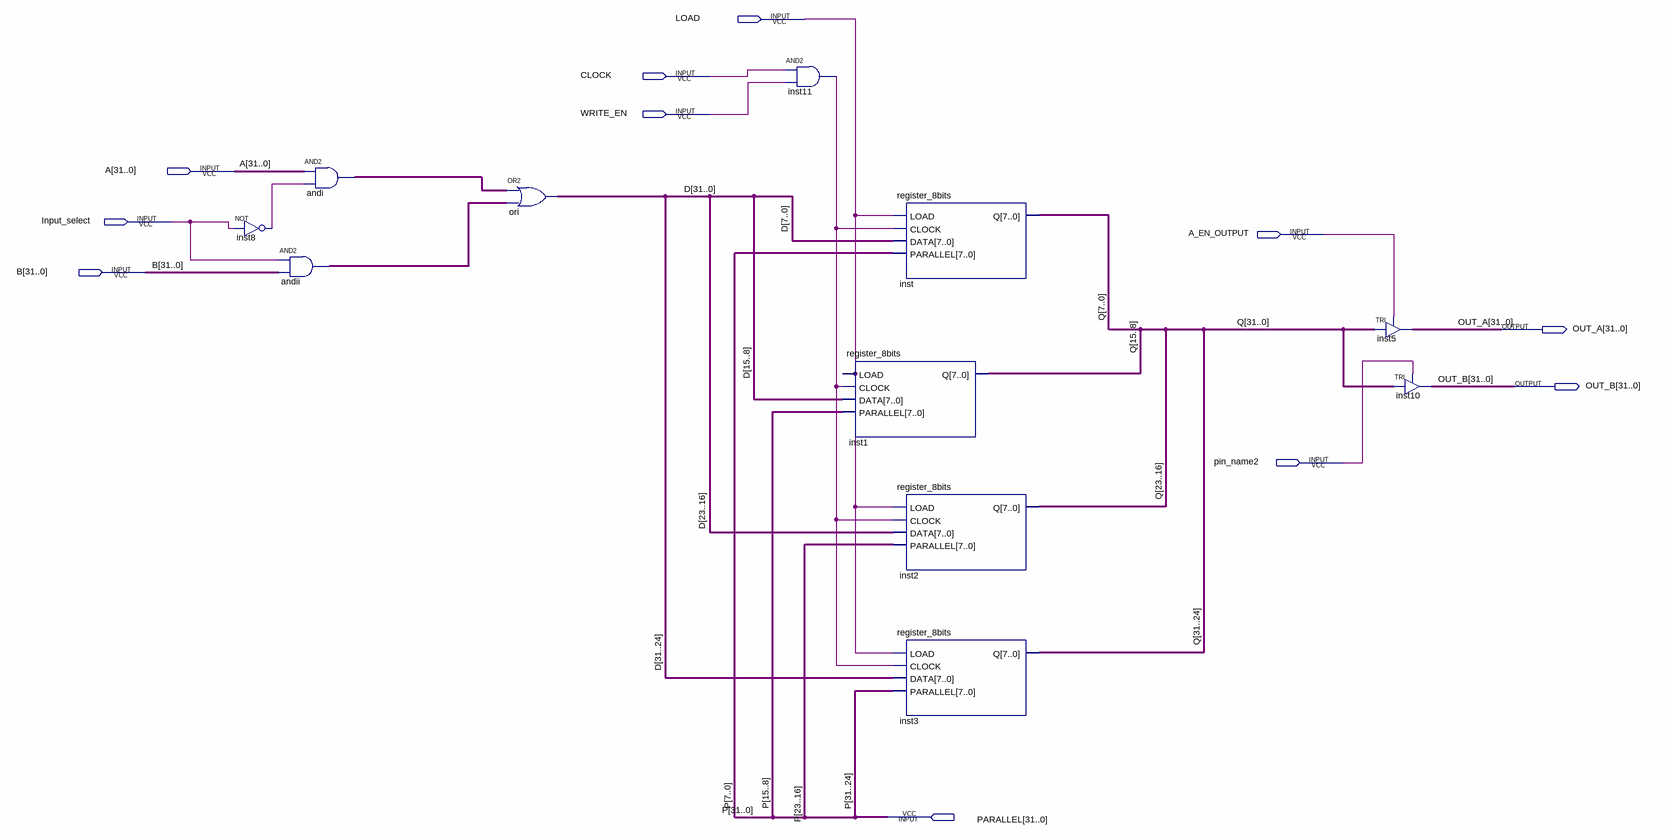
[diagram p0: schematic sheet]
// Quartus schematic register_32bits.bdf as structural Verilog: 11 symbols, 11 pins
module register_32bits (
  input  LOAD,
  input  CLOCK,
  input  WRITE_EN,
  input  [31:0] A,
  input  Input_select,
  input  A_EN_OUTPUT,
  input  [31:0] B,
  input  pin_name2,
  input  [31:0] PARALLEL,
  output [31:0] OUT_A,
  output [31:0] OUT_B
);

  wire inst8_out, inst11_out;
  wire [31:0] andi_out, andii_out, D, Q;

  not inst8 (inst8_out, Input_select);
  assign andii_out = {32{Input_select}} & B;  // AND2 andii, 32 bits wide
  assign andi_out = A & {32{inst8_out}};  // AND2 andi, 32 bits wide
  assign D = andi_out | andii_out;  // OR2 ori, 32 bits wide
  and inst11 (inst11_out, CLOCK, WRITE_EN);
  register_8bits inst1 (.LOAD(LOAD), .CLOCK(inst11_out), .DATA(D[15:8]), .PARALLEL(PARALLEL[15:8]), .Q(Q[15:8]));
  register_8bits inst (.LOAD(LOAD), .CLOCK(inst11_out), .DATA(D[7:0]), .PARALLEL(PARALLEL[7:0]), .Q(Q[7:0]));
  register_8bits inst2 (.LOAD(LOAD), .CLOCK(inst11_out), .DATA(D[23:16]), .PARALLEL(PARALLEL[23:16]), .Q(Q[23:16]));
  register_8bits inst3 (.LOAD(LOAD), .CLOCK(inst11_out), .DATA(D[31:24]), .PARALLEL(PARALLEL[31:24]), .Q(Q[31:24]));
  TRI inst5[31:0] (.IN(Q), .OE(A_EN_OUTPUT), .OUT(OUT_A));
  TRI inst10[31:0] (.IN(Q), .OE(pin_name2), .OUT(OUT_B));

  // Other names for the same wires on the sheet: P[31:0] = PARALLEL
endmodule
